# Altium schematic sheet LCD_SDCARD.SchDoc
size A
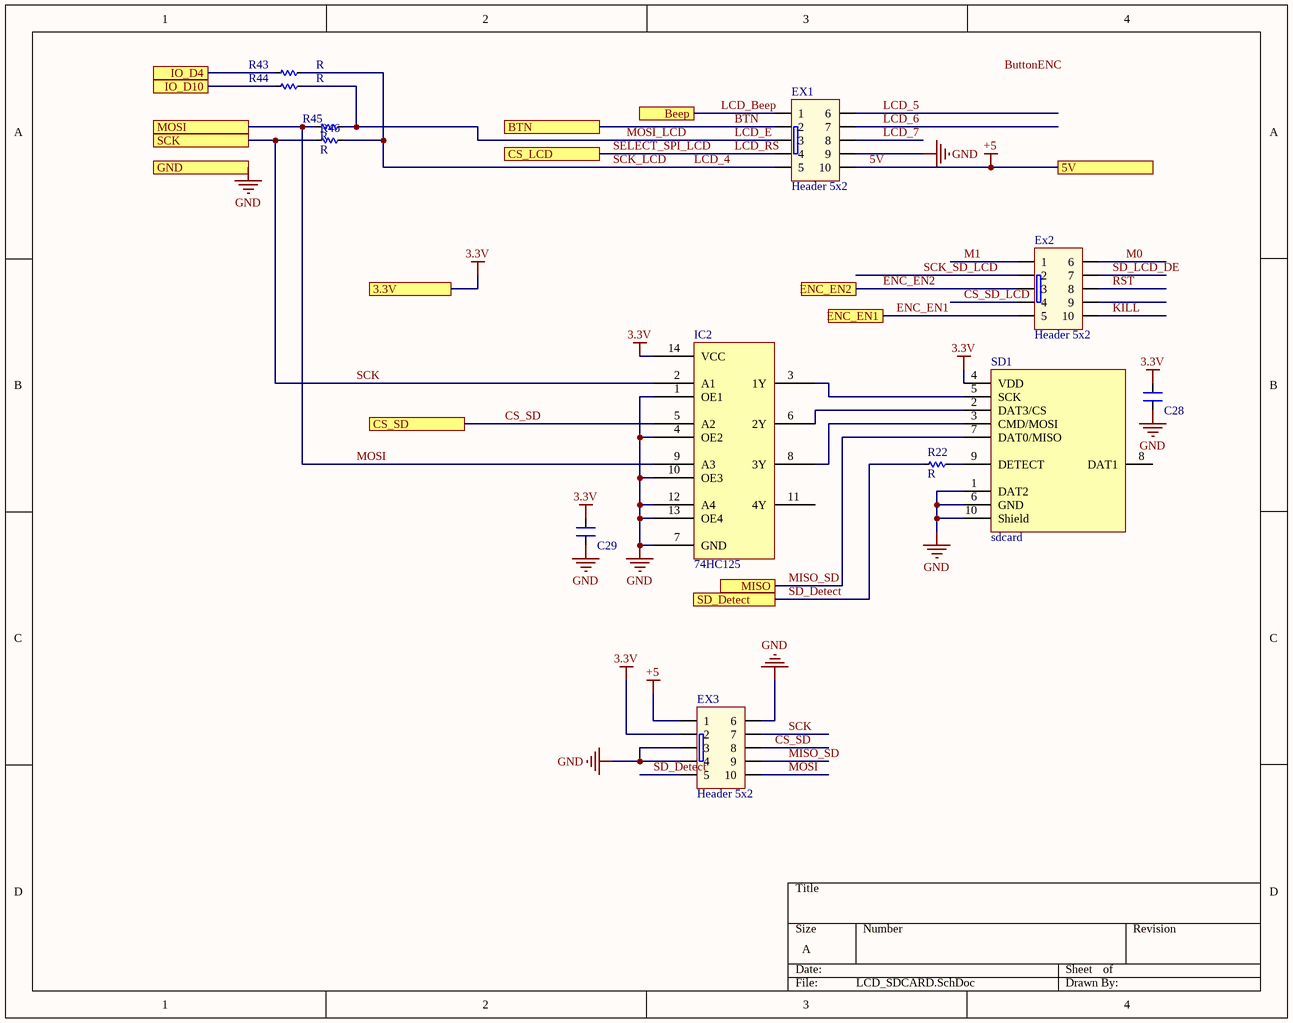
[diagram p0: LCD_SDCARD.SchDoc]

## Parts
C28  CN  [CN-SMD-0603_big]  (value not drawn)
C29  CN  [CN-SMD-0603_big]  (value not drawn)
EX1  Header 5x2  [Hed2X5]
Ex2  Header 5x2  [Hed2X5]
EX3  Header 5x2  [Hed2X5]
IC2  74HC125  [SO14]
R22  R  [RES-SMD-0603_BIG]
R43  R  [RES-SMD-0603_BIG]
R44  R  [RES-SMD-0603_BIG]
R45  R  [RES-SMD-0603_BIG]
R46  R  [RES-SMD-0603_BIG]
SD1  sdcard  [microSD™ Card_TF]

## Ports
3.3V, 5V, Beep, BTN, CS_LCD, CS_SD, ENC_EN1, ENC_EN2, GND, IO_D4, IO_D10, MISO, MOSI, SCK, SD_Detect

## Nets
3.3V: C28.2 C29.2 EX3.2 IC2.14(VCC) SD1.4(VDD) ; port 3.3V
5V: EX1.10 EX3.1 ; port 5V  [also labelled +5]
GND: C28.1 C29.1 EX1.9 EX3.3 EX3.4 EX3.6 IC2.1(OE1) IC2.4(OE2) IC2.7(GND) IC2.10(OE3) IC2.12(A4) IC2.13(OE4) SD1.1(DAT2) SD1.6(GND) SD1.10(Shield) ; port GND
BTN: EX1.2 ; port BTN
CS_SD: EX3.8 IC2.5(A2) ; port CS_SD
CS_SD_LCD: Ex2.4
ENC_EN1: Ex2.5 ; port ENC_EN1
ENC_EN2: Ex2.3 ; port ENC_EN2
IO_D4: R43.2 ; port IO_D4
IO_D10: R44.2 ; port IO_D10
KILL: Ex2.10
LCD_4: EX1.5 R43.1 R46.1  [also labelled SCK_LCD]
LCD_5: EX1.6
LCD_6: EX1.7
LCD_7: EX1.8
LCD_Beep: EX1.1 ; port Beep
LCD_E: EX1.3 R44.1 R45.1  [also labelled MOSI_LCD]
LCD_RS: EX1.4 ; port CS_LCD  [also labelled SELECT_SPI_LCD]
M0: Ex2.6
M1: Ex2.1
MISO_SD: EX3.9 SD1.7(DAT0/MISO) ; port MISO
MOSI: EX3.10 IC2.9(A3) R45.2 ; port MOSI
RST: Ex2.8
SCK: EX3.7 IC2.2(A1) R46.2 ; port SCK
SCK_SD_LCD: Ex2.2
SD_Detect: EX3.5 R22.2 ; port SD_Detect
SD_LCD_DE: Ex2.7
NetIC2_3: IC2.3(1Y) SD1.5(SCK)
NetIC2_6: IC2.6(2Y) SD1.2(DAT3/CS)
NetIC2_8: IC2.8(3Y) SD1.3(CMD/MOSI)
NetR22_1: R22.1 SD1.9(DETECT)

Not connected (* = marked no-connect by the designer): Ex2 9; IC2 11(4Y); SD1 8(DAT1)

## Notes on the sheet
- Labels drawn without touching a wire or pin: ButtonENC

## Library data of the parts
C28 C29 = CN: Value: 33pF
EX1 Ex2 EX3 = HED5x2: Value: Header 5x2